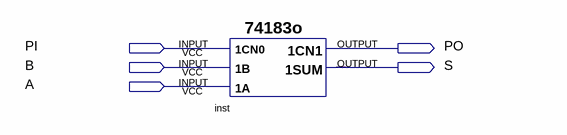
[diagram p0: schematic sheet]
// Quartus schematic CMB7.bdf as structural Verilog: 1 symbols, 5 pins
module CMB7 (
  input  PI,
  input  B,
  input  A,
  output PO,
  output S
);

  \74183o  inst (.\1SUM (S));  // open: 1CN0, 1A, 1B, 1CN1
endmodule
